# Altium schematic sheet MainCyclomotion.SchDoc: Main cyclomotion
size A3; SheetNumber: 1; SheetTotal: 1
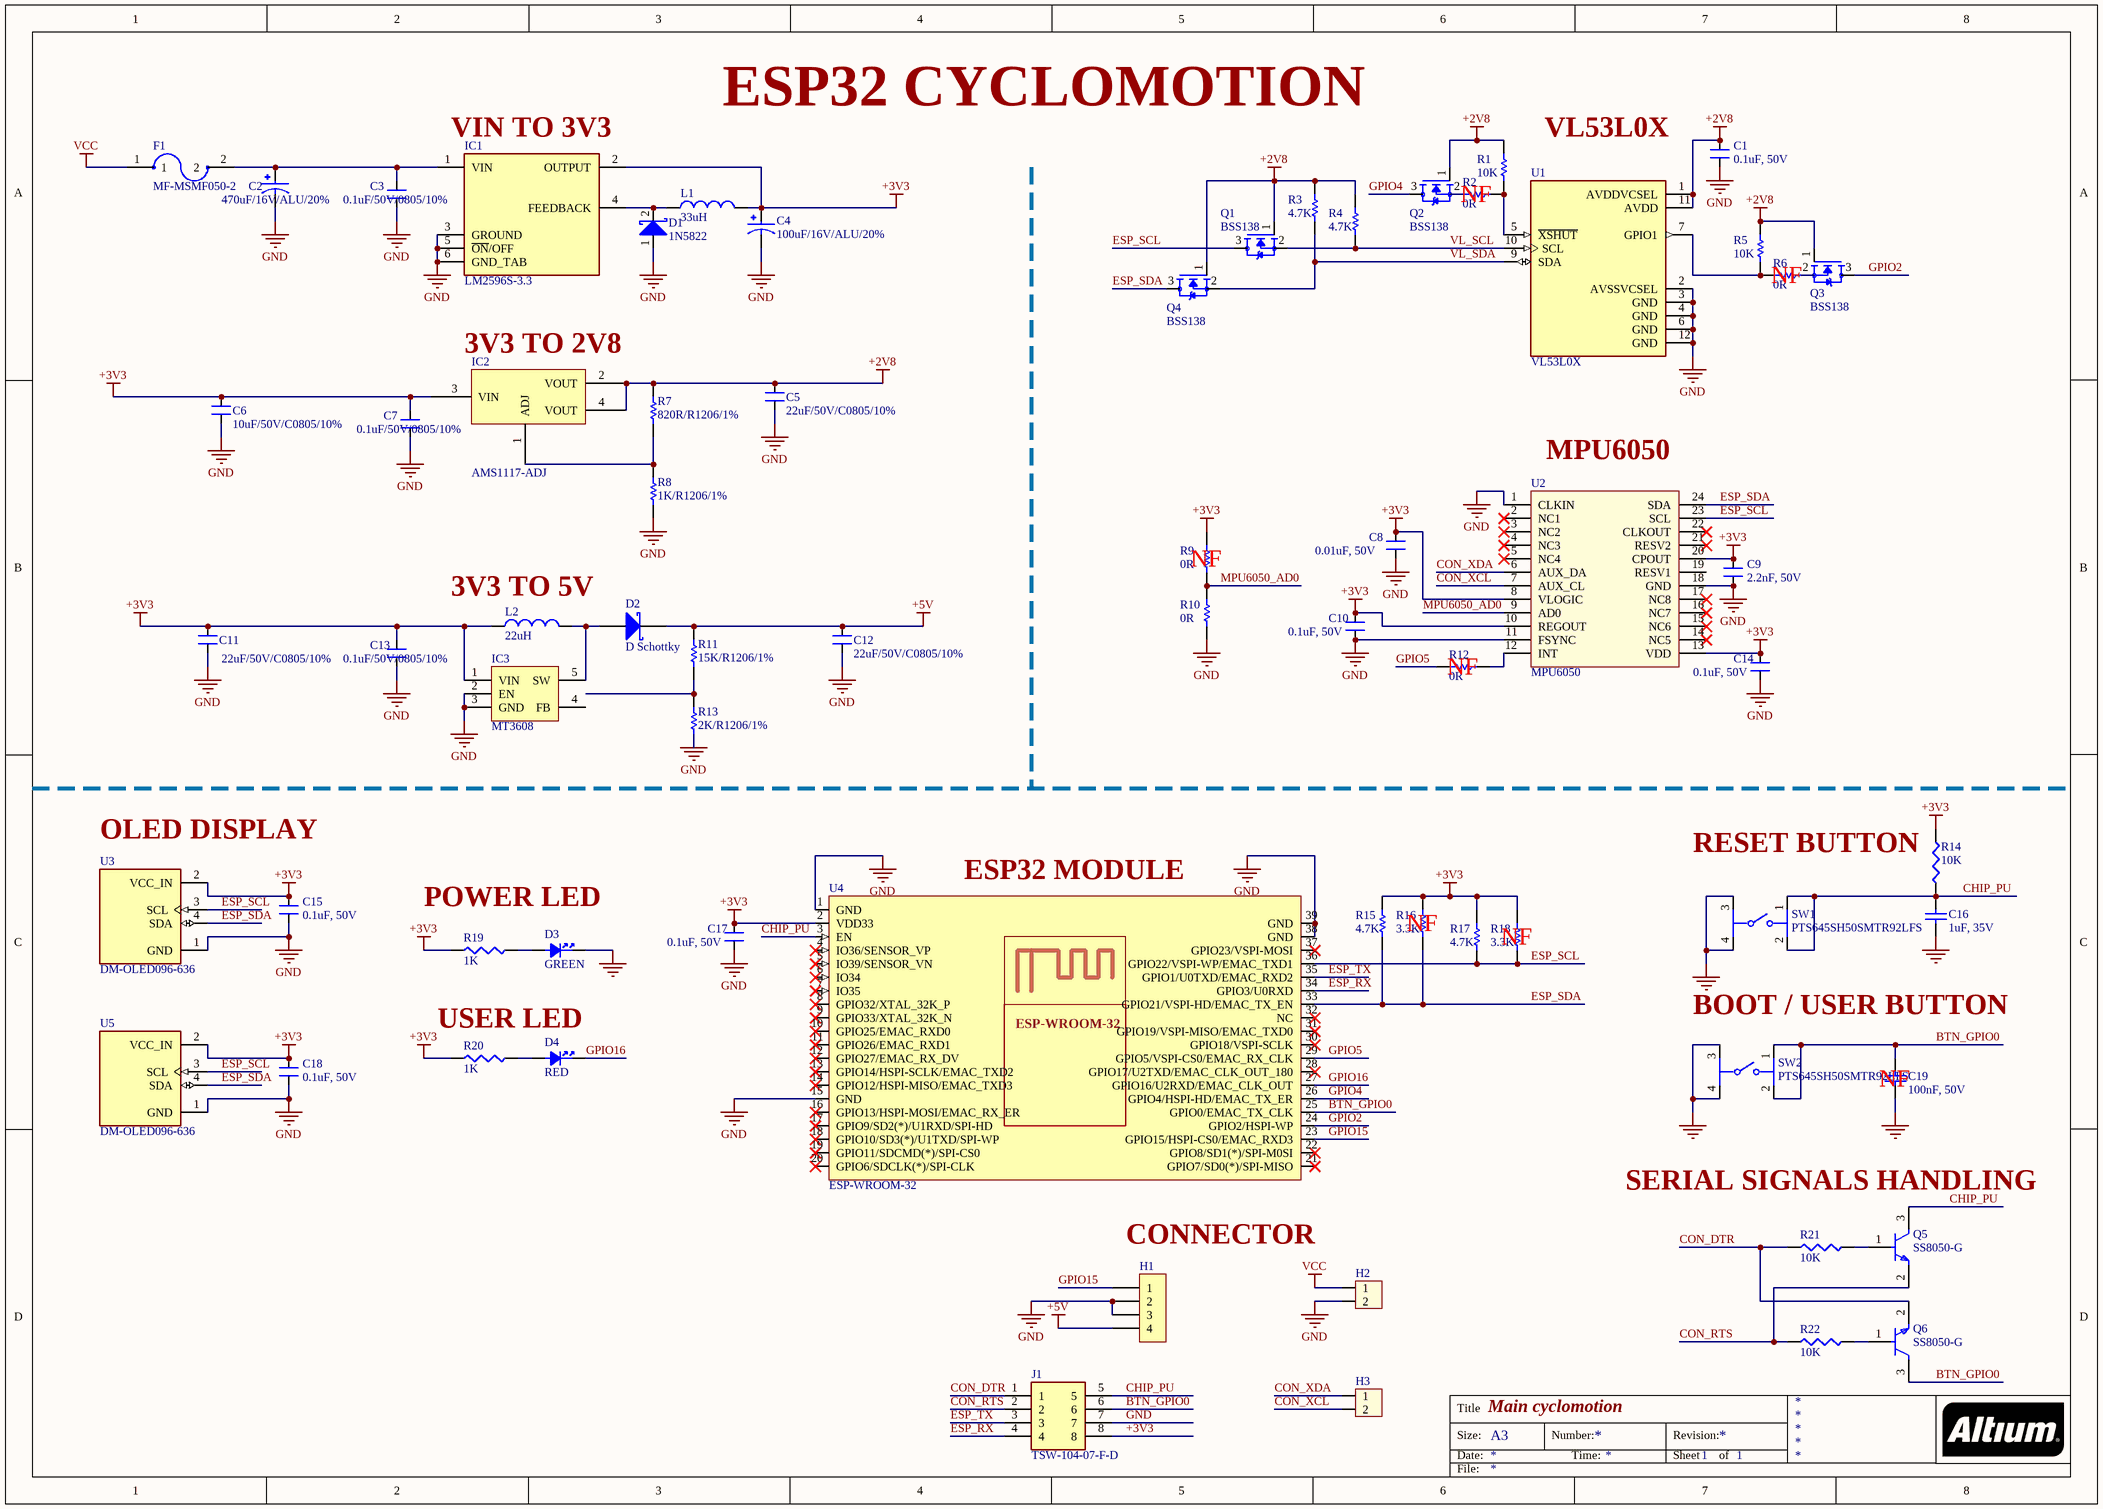
[diagram p0: MainCyclomotion.SchDoc]

## Parts
C1  0.1uF, 50V  [CAP_CERA_C2012(CC0805INCH)]
C2  470uF/16V/ALU/20%  [Cap_ALU_D_SMD]
C3  0.1uF/50V/0805/10%  [CAP_CERA_C2012(CC0805INCH)]
C4  100uF/16V/ALU/20%  [Cap_ALU_E_SMD]
C5  22uF/50V/C0805/10%  [CAP_CERA_C2012(CC0805INCH)]
C6  10uF/50V/C0805/10%  [CAP_CERA_C2012(CC0805INCH)]
C7  0.1uF/50V/0805/10%  [CAP_CERA_C2012(CC0805INCH)]
C8  0.01uF, 50V  [CAP_CERA_C2012(CC0805INCH)]
C9  2.2nF, 50V  [CAP_CERA_C2012(CC0805INCH)]
C10  0.1uF, 50V  [CAP_CERA_C2012(CC0805INCH)]
C11  22uF/50V/C0805/10%  [CAP_CERA_C2012(CC0805INCH)]
C12  22uF/50V/C0805/10%  [CAP_CERA_C2012(CC0805INCH)]
C13  0.1uF/50V/0805/10%  [CAP_CERA_C2012(CC0805INCH)]
C14  0.1uF, 50V  [CAP_CERA_C2012(CC0805INCH)]
C15  0.1uF, 50V  [CAP_CERA_C2012(CC0805INCH)]
C16  1uF, 35V  [CAPC1005X55N]
C17  0.1uF, 50V  [CAP_CERA_C2012(CC0805INCH)]
C18  0.1uF, 50V  [CAP_CERA_C2012(CC0805INCH)]
C19  100nF, 50V  [CAPC1005X55N]
D1  1N5822  [D_1N5822_DO201AD_THT]
D2  D Schottky  [DIODE SMA]
D3  GREEN  [LED0402G]
D4  RED  [LED0402R]
F1  MF-MSMF050-2  [FUSM4632X85]
H1  Header 4P 2.54 Duc Thang  [XH2.54M-4]  (value not drawn)
H2  Header 2P 2.54 Duc Thang  [XH2.54M-2]  (value not drawn)
H3  Header 2P 2.54 Duc Thang  [XH2.54M-2]  (value not drawn)
IC1  LM2596S-3.3  [TO170P1524X483-6N]
IC2  AMS1117-ADJ  [SOT223]
IC3  MT3608  [SOT23-5]
J1  TSW-104-07-F-D  [SAMTEC_TSW-104-07-F-D]
L1  value 33uH  [L_CDRH17_33uH_SMD]  (hidden comment: Inductor)
L2  value 22uH  [L_CDRH104_22uH_SMD]  (hidden comment: Inductor)
Q1  BSS138  [SOT95P240X111-3N]
Q2  BSS138  [SOT95P240X111-3N]
Q3  BSS138  [SOT95P240X111-3N]
Q4  BSS138  [SOT95P240X111-3N]
Q5  SS8050-G  [FP-SS8050-G-IPC_B]
Q6  SS8050-G  [FP-SS8050-G-IPC_B]
R1  10K  [Res 1206 SMD]
R2  0R  [Res 1206 SMD]
R3  4.7K  [Res 1206 SMD]
R4  4.7K  [Res 1206 SMD]
R5  10K  [Res 1206 SMD]
R6  0R  [Res 1206 SMD]
R7  820R/R1206/1%  [Res 1206 SMD]
R8  1K/R1206/1%  [Res 1206 SMD]
R9  0R  [Res 1206 SMD]
R10  0R  [Res 1206 SMD]
R11  15K/R1206/1%  [Res 1206 SMD]
R12  0R  [Res 1206 SMD]
R13  2K/R1206/1%  [Res 1206 SMD]
R14  10K  [RESC1005X37N]
R15  4.7K  [Res 1206 SMD]
R16  3.3K  [Res 1206 SMD]
R17  4.7K  [Res 1206 SMD]
R18  3.3K  [Res 1206 SMD]
R19  1K  [RESC1005X37N]
R20  1K  [RESC1005X37N]
R21  10K  [RESC1005X37N]
R22  10K  [RESC1005X37N]
SW1  PTS645SH50SMTR92LFS  [FP-PTS645SH50SMTR92LFS-MFG]
SW2  PTS645SH50SMTR92LFS  [FP-PTS645SH50SMTR92LFS-MFG]
U1  VL53L0X  [SENSOR_VL53L0X]
U2  MPU6050  [14# MPU -6050]
U3  DM-OLED096-636  [MODULE_DM-OLED096-636]
U4  ESP-WROOM-32  [ESP32 WROOM]
U5  DM-OLED096-636  [MODULE_DM-OLED096-636]

## Nets
+2V8: C1.1 C5.2 IC2.2(VOUT) IC2.4(VOUT) Q1.1(G) Q2.1(G) Q3.1(G) Q4.1(G) R1.2 R3.2 R4.2 R5.2 R7.1 U1.1(AVDDVCSEL) U1.11(AVDD)
+3V3: C4.1 C6.2 C7.1 C8.1 C9.1 C10.1 C11.2 C13.1 C14.1 C15.1 C17.1 C18.1 IC1.2(OUTPUT) IC2.3(VIN) IC3.1(VIN) J1.8 L1.2 L2.1 R9.2 R14.2 R15.2 R16.2 R17.2 R18.2 R19.2 R20.2 U2.8(VLOGIC) U2.10(REGOUT) U2.13(VDD) U2.20(CPOUT) U3.2(VCC_IN) U4.2(VDD33) U5.2(VCC_IN)
+5V: C12.2 D2.2(K) H1.4 R11.1
GND: C1.2 C2.2 C3.2 C4.2 C5.1 C6.1 C7.2 C8.2 C9.2 C10.2 C11.1 C12.1 C13.2 C14.2 C15.2 C16.1 C17.2 C18.2 C19.1 D1.1(A) D3.1 H1.2 H1.3 H2.2 IC1.3(GROUND) IC1.5(~{ON}/OFF) IC1.6(GND_TAB) IC3.2(EN) IC3.3(GND) J1.7 R8.2 R10.1 R13.2 SW1.3 SW1.4 SW2.3 SW2.4 U1.2(AVSSVCSEL) U1.3(GND) U1.4(GND) U1.6(GND) U1.12(GND) U2.1(CLKIN) U2.11(FSYNC) U2.18(GND) U3.1(GND) U4.1(GND) U4.15(GND) U4.38(GND) U4.39(GND) U5.1(GND)
VCC: F1.1 H2.1
BTN_GPIO0: C19.2 J1.6 Q6.3(C) SW2.1 SW2.2 U4.25(GPIO0/EMAC_TX_CLK)
CHIP_PU: C16.2 J1.5 Q5.3(C) R14.1 SW1.1 SW1.2 U4.3(EN)
CON_DTR: J1.1 Q6.2(E) R21.1
CON_RTS: J1.2 Q5.2(E) R22.1
CON_XCL: H3.2 U2.7(AUX_CL)
CON_XDA: H3.1 U2.6(AUX_DA)
ESP_RX: J1.4 U4.34(GPIO3/U0RXD)
ESP_SCL: Q1.3(D) R17.1 R18.1 U2.23(SCL) U3.3(SCL) U4.36(GPIO22/VSPI-WP/EMAC_TXD1) U5.3(SCL)
ESP_SDA: Q4.3(D) R15.1 R16.1 U2.24(SDA) U3.4(SDA) U4.33(GPIO21/VSPI-HD/EMAC_TX_EN) U5.4(SDA)
ESP_TX: J1.3 U4.35(GPIO1/U0TXD/EMAC_RXD2)
GPIO2: Q3.3(D) U4.24(GPIO2/HSPI-WP)
GPIO4: Q2.3(D) U4.26(GPIO4/HSPI-HD/EMAC_TX_ER)
GPIO5: R12.2 U4.29(GPIO5/VSPI-CS0/EMAC_RX_CLK)
GPIO15: H1.1 U4.23(GPIO15/HSPI-CS0/EMAC_RXD3)
GPIO16: D4.1 U4.27(GPIO16/U2RXD/EMAC_CLK_OUT)
MPU6050_AD0: R9.1 R10.2 U2.9(AD0)
VL_SCL: Q1.2(S) R4.1 U1.10(SCL)
VL_SDA: Q4.2(S) R3.1 U1.9(SDA)
NetC2_1: C2.1 C3.1 F1.2 IC1.1(VIN)
NetD1_2: D1.2(K) IC1.4(FEEDBACK) L1.1
NetD2_1: D2.1(A) IC3.5(SW) L2.2
NetD3_2: D3.2 R19.1
NetD4_2: D4.2 R20.1
NetIC2_1: IC2.1(ADJ) R7.2 R8.1
NetQ2_2: Q2.2(S) R2.2
NetQ3_2: Q3.2(S) R6.1
NetQ5_1: Q5.1(B) R21.2
NetQ6_1: Q6.1(B) R22.2
NetR1_1: R1.1 R2.1 U1.5(~{XSHUT})
NetR5_1: R5.1 R6.2 U1.7(GPIO1)
NetR11_2: R11.2 R13.1
NetR12_1: R12.1 U2.12(INT)

Not connected (* = marked no-connect by the designer): IC3 4(FB); U2 2(NC1)* 3(NC2)* 4(NC3)* 5(NC4)* 14(NC5)* 15(NC6)* 16(NC7)* 17(NC8)* 19(RESV1) 21(RESV2)* 22(CLKOUT)*; U4 4(IO36/SENSOR_VP)* 5(IO39/SENSOR_VN)* 6(IO34)* 7(IO35)* 8(GPIO32/XTAL_32K_P)* 9(GPIO33/XTAL_32K_N)* 10(GPIO25/EMAC_RXD0)* 11(GPIO26/EMAC_RXD1)* 12(GPIO27/EMAC_RX_DV)* 13(GPIO14/HSPI-SCLK/EMAC_TXD2)* 14(GPIO12/HSPI-MISO/EMAC_TXD3)* 16(GPIO13/HSPI-MOSI/EMAC_RX_ER)* 17(GPIO9/SD2(*)/U1RXD/SPI-HD)* 18(GPIO10/SD3(*)/U1TXD/SPI-WP)* 19(GPIO11/SDCMD(*)/SPI-CS0)* 20(GPIO6/SDCLK(*)/SPI-CLK)* 21(GPIO7/SD0(*)/SPI-MISO)* 22(GPIO8/SD1(*)/SPI-M0SI)* 28(GPIO17/U2TXD/EMAC_CLK_OUT_180)* 30(GPIO18/VSPI-SCLK)* 31(GPIO19/VSPI-MISO/EMAC_TXD0)* 32(NC)* 37(GPIO23/VSPI-MOSI)*

## Notes on the sheet
- ESP32 CYCLOMOTION
- (near IC1) VIN TO 3V3
- VL53L0X
- (near R2) NF
- (near R6) NF
- (near IC2) 3V3 TO 2V8
- (near U2) MPU6050
- (near L2) 3V3 TO 5V
- (near R9) NF
- (near R12) NF
- (near U3) OLED DISPLAY
- RESET BUTTON
- POWER LED
- (near U4) ESP32 MODULE
- (near R16) NF
- (near R18) NF
- USER LED
- BOOT / USER BUTTON
- (near C19) NF
- SERIAL SIGNALS HANDLING
- CONNECTOR
- Title
- Size:
- Date:
- A3
- Number:
- Time:
- Revision:
- Sheet
- of
- File:

## Library data of the parts
C1 C3 C5-C15 C17 C18 = CAP CERA 0805: CERAMIC CAP 0805; Value: 100pF, 2012
C2 = Cap_ALU_D_SMD
C4 = Cap_ALU_E_SMD
C16 = CL05A105KL5NRNC: CAP CER 1UF 35V X5R 0402; Manufacturer: Samsung; Dielectric Material: Ceramic; Multilayer: Yes; Tolerance  (fill in as +-): 10%; Supplier: Digikey; Supplier Part Number: 1276-6796-1-ND; Manufacturer Part Number: CL05A105KL5NRNC; RoHS: Yes; Category: Ceramic Capacitors; Stock: 469958; Pricing: 1=0.33, 10=0.212, 50=0.149, 100=0.1202, 500=0.08934, 1000=0.07818, 2500=0.07446, 5000=0.06887 (USD); Mounting Technology: Surface Mount; Pins: 2; Package Shape: Rectangular; Case/Package: 0402; Terminal Finish: Nickel; Min Operating Temperature: -55°C; Max Operating Temperature: 85°C; JESD-609 Code: e3; Value: 1uF; Capacitor Type: Ceramic; Packaging: Tape and Reel; Tolerance (fill in as +-): 10%; Rated DC Voltage (URdc): 35V; Temperature Characteristics Code: X5R; Termination: Wraparound; Reach SVHC Compliant: Yes; RoHS Compliant: Yes; ComponentLink1URL: https://datasheet.ciiva.com:443/pdfs/VipMasterIC/IC/SEMS/SEMS-S-A0008384515/SEMS-S-A0008872905-1.pdf?src-supplier=IHS+Markit; ComponentLink1Description: https://datasheet.ciiva.com:443/pdfs/VipMasterIC/IC/SEMS/SEMS-S-A0008384515/SEMS-S-A0008872905-1.pdf?src-supplier=IHS+Markit; ComponentLink2URL: http://www.samsungsem.com/kr/support/product-search/mlcc/CL05A105KL5NRNC.jsp?src-supplier=Digikey; ComponentLink2Description: http://www.samsungsem.com/kr/support/product-search/mlcc/CL05A105KL5NRNC.jsp?src-supplier=Digikey; LCSC Part Number: C307413
C19 = CL05B104KB54PNC: CAP CER 0.1UF 50V X7R 0402; Manufacturer: Samsung; Dielectric Material: Ceramic; Supplier: Digikey; Supplier Part Number: 1276-CL05B104KB54PNCCT-ND; Manufacturer Part Number: CL05B104KB54PNC; RoHS: Yes; Category: Ceramic Capacitors; Stock: 1237875; Pricing: 1=0.1, 10=0.044, 50=0.025, 100=0.0194, 500=0.0146, 1000=0.01147, 2500=0.01043, 5000=0.00959 (USD); Pins: 2; Capacitor Type: Ceramic; RoHS Compliant: Yes; Reach SVHC Compliant: Yes; ComponentLink1URL: https://datasheet.ciiva.com:443/pdfs/VipMasterIC/IC/SEMS/SEMS-S-A0006318249/SEMS-S-A0006320959-1.pdf?src-supplier=IHS+Markit; ComponentLink1Description: https://datasheet.ciiva.com:443/pdfs/VipMasterIC/IC/SEMS/SEMS-S-A0006318249/SEMS-S-A0006320959-1.pdf?src-supplier=IHS+Markit; ComponentLink2URL: https://datasheet.octopart.com/CL05B104KB54PNC-Samsung-datasheet-8326407.pdf?src-supplier=TME; ComponentLink2Description: https://datasheet.octopart.com/CL05B104KB54PNC-Samsung-datasheet-8326407.pdf?src-supplier=TME; LCSC Part Number: C307331
D1 = 1N5822: Schottky Diode 3A 40V DO-201AD; ComponentLink1Description: Datasheet; ComponentLink1URL: D:\Dropbox\Datasheets\Diodes and Rectifiers\Diodes\1N582X.pdf; Unit Price: 0.1667
D2 = D Schottky: Schottky Diode; Published: 8-Jun-2000; LatestRevisionDate: 17-Jul-2002; LatestRevisionNote: Re-released for DXP Platform.; PackageReference: SMB; Publisher: Altium Limited; PackageDescription: DO-214-AA/SMB; 2 C-Bend Leads; Body 5.3 x 3.6 mm, inc. leads (LxW); Code_JEDEC: DO-214-AA
D3 = VLMG1500-GS08: LED YLW-GRN 0402 SMD; Manufacturer: Vishay; Color: Green,Yellow; Lens Color: Clear; Viewing Angle: 130°; Forward Current: 30mA; Forward Voltage: 2V; Luminous Intensity: 35mcd; Dominant Wavelength: 571nm; Test Current: 20mA; Number of Elements: 1; Power Dissipation: 75mW; Lens Style: Rectangular; Reverse Voltage: 5V; Supplier: Digikey; Supplier Part Number: VLMG1500-GS08CT-ND; Manufacturer Part Number: VLMG1500-GS08; RoHS: Yes; Category: LEDs; Stock: 98; Pricing: 1=0.34, 10=0.265, 100=0.119, 500=0.10746, 1000=0.08827 (USD); Mounting Technology: Surface Mount; Case/Package: 0402; Pins: 2; Case Code (Metric): 1005; Case Code (Imperial): 0402; Min Operating Temperature: -30°C; Max Operating Temperature: 85°C; Package Quantity: 1; Packaging: Tape and Reel; Illumination Color: Green; Wavelength: 571nm; Number of LEDs: 1; Power Rating: 75mW; Series: CHipLED; Length: 1mm; Width: 0.5mm; Height: 0.35mm; Depth: 0.5mm; Radiation Hardening: No; Lead Free: Lead Free; RoHS Compliant: Yes; Reach SVHC Compliant: Unknown; ComponentLink1URL: https://datasheet.ciiva.com/12071/vlmo1500-244705-12071911.pdf?src-supplier=Mouser; ComponentLink1Description: https://datasheet.ciiva.com/12071/vlmo1500-244705-12071911.pdf?src-supplier=Mouser; ComponentLink2URL: https://datasheet.ciiva.com/30005/vlmo1500-30005134.pdf?src-supplier=Avnet; ComponentLink2Description: https://datasheet.ciiva.com/30005/vlmo1500-30005134.pdf?src-supplier=Avnet; LCSC Part Number: C511404
D4 = VLMS1500-GS08: LED RED 0402 SMD; Manufacturer: Vishay; Shape: Rectangular; Forward Current: 30mA; Forward Voltage: 2.4V; Luminous Intensity-Nom: 54mcd; Channels: 1; Optoelectronic Device Type: SINGLE COLOR LED; Reverse Voltage-Max: 5V; Viewing Angle: 130°; Overall Height: 0.35mm; Supplier: Digikey; Supplier Part Number: VLMS1500-GS08CT-ND; Manufacturer Part Number: VLMS1500-GS08; RoHS: Yes; Category: LEDs; Stock: 70376; Pricing: 1=0.34, 10=0.265, 100=0.119, 500=0.10746, 1000=0.08827 (USD); Mounting Technology: Surface Mount; Pins: 2; Color: Red; Color@wavelength: Red; Min Operating Temperature: -30°C; Max Operating Temperature: 85°C; Packaging: Tape and Reel; Size: 0.5mm; Terminal Pitch: 0.95mm; Reach SVHC Compliant: Yes; RoHS Compliant: Yes; ComponentLink1URL: https://datasheet.ciiva.com:443/pdfs/VipMasterIC/IC/VISH/VISH-S-A0003457490/VISH-S-A0003457490-1.pdf?src-supplier=IHS+Markit; ComponentLink1Description: https://datasheet.ciiva.com:443/pdfs/VipMasterIC/IC/VISH/VISH-S-A0003457490/VISH-S-A0003457490-1.pdf?src-supplier=IHS+Markit; ComponentLink2URL: http://www.farnell.com/datasheets/1809983.pdf?src-supplier=Farnell; ComponentLink2Description: http://www.farnell.com/datasheets/1809983.pdf?src-supplier=Farnell; ComponentLink3URL: http://www.mouser.com/ds/2/427/vlmo1500-244705.pdf?src-supplier=Mouser; ComponentLink3Description: http://www.mouser.com/ds/2/427/vlmo1500-244705.pdf?src-supplier=Mouser; ComponentLink4URL: https://datasheet.octopart.com/VLMS1500-GS08-Vishay-datasheet-62332426.pdf?src-supplier=Newark; ComponentLink4Description: https://datasheet.octopart.com/VLMS1500-GS08-Vishay-datasheet-62332426.pdf?src-supplier=Newark; ComponentLink5URL: https://datasheet.octopart.com/VLMS1500-GS08-Vishay-datasheet-33014519.pdf?src-supplier=Element14; ComponentLink5Description: https://datasheet.octopart.com/VLMS1500-GS08-Vishay-datasheet-33014519.pdf?src-supplier=Element14; ComponentLink6URL: http://datasheet.octopart.com/VLMS1500-GS08-Vishay-datasheet-21227148.pdf?src-supplier=Avnet; ComponentLink6Description: http://datasheet.octopart.com/VLMS1500-GS08-Vishay-datasheet-21227148.pdf?src-supplier=Avnet; ComponentLink7URL: http://www.farnell.com/datasheets/1809983.pdf?src-supplier=Newark; ComponentLink7Description: http://www.farnell.com/datasheets/1809983.pdf?src-supplier=Newark; ComponentLink8URL: http://www.farnell.com/datasheets/2050839.pdf?src-supplier=Newark; ComponentLink8Description: http://www.farnell.com/datasheets/2050839.pdf?src-supplier=Newark; ComponentLink9URL: http://datasheet.octopart.com/VLMS1500-GS08-Vishay-datasheet-21227148.pdf?src-supplier=Quest; ComponentLink9Description: http://datasheet.octopart.com/VLMS1500-GS08-Vishay-datasheet-21227148.pdf?src-supplier=Quest; ComponentLink10URL: http://datasheet.octopart.com/VLMS1500-GS08-Vishay-datasheet-21227148.pdf?src-supplier=NAC+Semi; ComponentLink10Description: http://datasheet.octopart.com/VLMS1500-GS08-Vishay-datasheet-21227148.pdf?src-supplier=NAC+Semi; LCSC Part Number: C511370
F1 = MF-MSMF050-2: Polymeric PTC Resettable Fuse 15V 500 mA Ih Surface Mount 1812 (4532 Metric), Concave; MF: Bourns; MP: MF-MSMF050-2; Availability: In Stock; Check_prices: https://www.snapeda.com/parts/MF-MSMF050-2/Bourns+-+J.W.+Miller/view-part/?ref=eda; Price: None; Package: 1812 Bourns; Purchase-URL: https://pricing.snapeda.com/search/part/MF-MSMF050-2/?ref=eda; Value: *; SnapEDA_Link: https://www.snapeda.com/parts/MF-MSMF050-2/Bourns+-+J.W.+Miller/view-part/?ref=snap
H1 = Header 4P 2.54 Duc Thang: Cắm; Ten_Linh_Kien: Header 4P XH2.54-4P Đực Thẳng; Don_Vi: Con; Ma_Hang: MH001285; Chung_Loai: Cắm
H2 H3 = Header 2P 2.54 Duc Thang: Cắm; Ten_Linh_Kien: Header 2P XH2.54-2P Đực Thẳng; Don_Vi: Con; Ma_Hang: MH001283; Chung_Loai: Cắm
IC1 = LM2596S-3.3: SIMPLE SWITCHER® 4.5V to 40V, 3A Low Component Count Step-Down Regulator
IC2 = AMS1117 SMD: Dán; Value: AMS1117-3.3V SOT223; Don_Vi: Con; Ma_Hang: MH000596; Ghi_Chu: *; Kieu_Chan: *; Chung_Loai: Dán
IC3 = MT3608: The MT3608 is a constant frequency, 6-pin SOT23 / current mode step-up converter; Manufacturer: AEROSEMI; Alternate Part Number-1: NA; Manufacturer Part Number: MT3608; Case/Package: SOT-23-5; Supplier-1: NA; Supplier Part Number-1: NA
L1 L2 = Inductor: Code_IEC: 1005; Published: 8-Jun-2000; LatestRevisionDate: 29-May-2009; LatestRevisionNote: IPC-7351 Footprint Added.; PackageReference: 0402-A; Publisher: Altium Limited; PackageDescription: Chip Inductor; Code_JEITA: 0402
Q1-Q4 = BSS138: N-Channel 50 V 220mA (Ta) 350mW (Ta) Surface Mount SOT-23-3
Q5 Q6 = SS8050-G: TRANS NPN 25V 1.5A SOT23-3; Manufacturer: Comchip; Supplier: Digikey; Supplier Part Number: 641-1790-1-ND; Manufacturer Part Number: SS8050-G; RoHS: Yes; Category: Transistors; Stock: 108568; Pricing: 1=0.29, 10=0.2, 100=0.0978, 500=0.08154, 1000=0.05666 (USD); Reach SVHC Compliant: Yes; RoHS Compliant: Yes; ComponentLink1URL: https://datasheet.ciiva.com:443/pdfs/VipMasterIC/IC/COMC/COMC-S-A0004994192/COMC-S-A0004994192-1.pdf?src-supplier=IHS+Markit; ComponentLink1Description: https://datasheet.ciiva.com:443/pdfs/VipMasterIC/IC/COMC/COMC-S-A0004994192/COMC-S-A0004994192-1.pdf?src-supplier=IHS+Markit; ComponentLink2URL: http://www.comchiptech.com/admin/files/product/SS8050-G RevA181526.pdf?src-supplier=Digikey; ComponentLink2Description: http://www.comchiptech.com/admin/files/product/SS8050-G RevA181526.pdf?src-supplier=Digikey; LCSC Part Number: C164886
R1-R13 R15-R18 = RES-1206: RES SMD 10K OHM 1% 1206; Manufacturer: Yageo; Manufacturer Part Number: RC1206FR-075R1L; Resistance (Ohms): 5.1; Power (Watts): 0.25W, 1/4W; Temperature Coefficient: ±200ppm/°C; Supplier 1: Digi-Key; RoHS: RoHS Compliant; Category: Resistors; Stock 1: 96701; Pricing 1: 1=0.1, 10=0.051, 100=0.0207, 1000=0.0093, 2500=0.00807 (USD); Packaging: Cut Tape (CT); Part Status: Active; Tolerance: ±1%; Composition: Thick Film; Features: Moisture Resistant; Operating Temperature: -55°C ~ 155°C; Package / Case: 1206 (3216 Metric); Supplier Device Package: 1206; Size / Dimension: 0.122" L x 0.063" W (3.10mm x 1.60mm); Height - Seated (Max): 0.026" (0.65mm); Failure Rate: -; ComponentLink1URL: http://www.yageo.com/documents/recent/PYu-RC_Group_51_RoHS_L_7.pdf; ComponentLink1Description: http://www.yageo.com/documents/recent/PYu-RC_Group_51_RoHS_L_7.pdf; Supplier Part Number 1: 311-5.10FRCT-ND
R14 R21 R22 = AC0402FR-0710KL: RES SMD 10K OHM 1% 1/16W 0402; Manufacturer: Yageo; Additional Feature: LASER TRIMMABLE; Power: 62.5mW; Rated Temperature: 70°C; Value: 10kR; Temperature Coefficient: 100ppm/°C; Working Voltage: 50V; Package Height: 0.32mm; Package Length: 1mm; Package Width: 0.5mm; Reference Standard: AEC-Q200; Supplier: Digikey; Supplier Part Number: YAG3436CT-ND; Manufacturer Part Number: AC0402FR-0710KL; RoHS: Yes; Category: Chip SMD Resistors; Stock: 1122213; Pricing: 1=0.1, 10=0.019, 50=0.0116, 100=0.0095, 500=0.00638, 1000=0.00544, 5000=0.00391 (USD); Mounting Technology: Surface Mount; Pins: 2; Package Shape: Rectangular; Case/Package: 0402; Terminal Finish: Nickel; Min Operating Temperature: -55°C; Max Operating Temperature: 155°C; Tolerance: 1%; JESD-609 Code: e3; Resistor Type: FIXED RESISTOR; Construction: Chip; Package Style: SMTMeter; Packaging: Tape and Reel; Technology: METAL GLAZE/THICK FILM; Termination: Wraparound; Reach SVHC Compliant: Yes; RoHS Compliant: Yes; ComponentLink1URL: https://datasheet.ciiva.com:443/pdfs/VipMasterIC/IC/YAGO/YAGO-S-A0003597364/YAGO-S-A0003597364-1.pdf?src-supplier=IHS+Markit; ComponentLink1Description: https://datasheet.ciiva.com:443/pdfs/VipMasterIC/IC/YAGO/YAGO-S-A0003597364/YAGO-S-A0003597364-1.pdf?src-supplier=IHS+Markit; ComponentLink2URL: https://datasheet.ciiva.com/12656/pyu-ac-51-rohs-l-2-12656634.pdf?src-supplier=Mouser; ComponentLink2Description: https://datasheet.ciiva.com/12656/pyu-ac-51-rohs-l-2-12656634.pdf?src-supplier=Mouser; LCSC Part Number: C144807
R19 R20 = RC0402FR-071KL: RES 1K OHM 1% 1/16W 0402; Manufacturer: Yageo; Additional Feature: LASER TRIMMABLE; Power: 62.5mW; Rated Temperature: 70°C; Value: 1kR; Temperature Coefficient: 100ppm/°C; Working Voltage: 50V; Package Height: 0.35mm; Package Length: 1mm; Package Width: 0.5mm; Supplier: Digikey; Supplier Part Number: 311-1.00KLRCT-ND; Manufacturer Part Number: RC0402FR-071KL; RoHS: Yes; Category: Chip SMD Resistors; Stock: 11967525; Pricing: 1=0.1, 10=0.015, 50=0.0088, 100=0.0073, 500=0.00488, 1000=0.00417, 5000=0.00297 (USD); Mounting Technology: Surface Mount; Pins: 2; Package Shape: Rectangular; Case/Package: 0402; Terminal Finish: Nickel; Min Operating Temperature: -55°C; Max Operating Temperature: 155°C; Tolerance: 1%; JESD-609 Code: e3; Resistor Type: FIXED RESISTOR; Construction: Chip; Package Style: SMTMeter; Packaging: Tape and Reel; Technology: METAL GLAZE/THICK FILM; Termination: Wraparound; Reach SVHC Compliant: Yes; RoHS Compliant: Yes; ComponentLink1URL: https://datasheet.ciiva.com:443/pdfs/VipMasterIC/IC/YAGO/YAGO-S-A0008145938/YAGO-S-A0008145938-1.pdf?src-supplier=IHS+Markit; ComponentLink1Description: https://datasheet.ciiva.com:443/pdfs/VipMasterIC/IC/YAGO/YAGO-S-A0008145938/YAGO-S-A0008145938-1.pdf?src-supplier=IHS+Markit; ComponentLink2URL: https://datasheet.ciiva.com/11819/0900766b80c66297-11819477.pdf?src-supplier=Rs; ComponentLink2Description: https://datasheet.ciiva.com/11819/0900766b80c66297-11819477.pdf?src-supplier=Rs; ComponentLink3URL: https://datasheet.ciiva.com/22747/1018594-22747513.pdf?src-supplier=Element14; ComponentLink3Description: https://datasheet.ciiva.com/22747/1018594-22747513.pdf?src-supplier=Element14; ComponentLink4URL: https://datasheet.ciiva.com/12666/pyu-rc0402-51-rohs-l-6-r-12666741.pdf?src-supplier=Mouser; ComponentLink4Description: https://datasheet.ciiva.com/12666/pyu-rc0402-51-rohs-l-6-r-12666741.pdf?src-supplier=Mouser; ComponentLink5URL: https://datasheet.ciiva.com/17063/pyu-rc0402-51-rohs-l-6-r-17063193.pdf?src-supplier=Future+Electronics; ComponentLink5Description: https://datasheet.ciiva.com/17063/pyu-rc0402-51-rohs-l-6-r-17063193.pdf?src-supplier=Future+Electronics; ComponentLink6URL: https://datasheet.ciiva.com/7983/1018594-7983502.pdf?src-supplier=Element14; ComponentLink6Description: https://datasheet.ciiva.com/7983/1018594-7983502.pdf?src-supplier=Element14; ComponentLink7URL: https://datasheet.ciiva.com/7849/1018594-7849869.pdf?src-supplier=Element14; ComponentLink7Description: https://datasheet.ciiva.com/7849/1018594-7849869.pdf?src-supplier=Element14; ComponentLink8URL: https://datasheet.ciiva.com/7849/1018594-7849871.pdf?src-supplier=Element14; ComponentLink8Description: https://datasheet.ciiva.com/7849/1018594-7849871.pdf?src-supplier=Element14; LCSC Part Number: C106235
SW1 SW2 = PTS645SH50SMTR92LFS: SWITCH TACTILE SPST-NO 0.05A 12V; Manufacturer: ITT C&K; Manufacturer Series: PTS645; Actuator Type: Pushbutton; Contact Current(DC)-Max: 50mA; Contact DC Max Rating R Load: 0.05A@12VDC; Contact Resistance: 0.1mR; Dielectric Withstand Volts: 250VACV; Electrical Life: 100000Cycles; Insulation Resistance: 100GR; PCB Hole Count: 4; Switch Action: MOMENTARY; Switch Function: SPST; Switch Type: Keypad; Body Breadth: 5.9944inch; Body Height: 3.4544mm; Body Length or Diameter: 5.9944mm; Supplier: Digikey; Supplier Part Number: CKN9085CT-ND; Manufacturer Part Number: PTS645SH50SMTR92LFS; RoHS: Yes; Category: Tactile Switches; Stock: 64637; Pricing: 1=0.35, 10=0.337, 25=0.3172, 100=0.2753, 250=0.24972, 500=0.2323 (USD); Mounting Technology: Surface Mount; Terminal Finish: Silver; Min Operating Temperature: -20°C; Max Operating Temperature: 60°C; JESD-609 Code: e4; Contact Voltage(DC)-Max: 12V; Termination: Solder; Terminal Length: 0.138inch; Reach SVHC Compliant: Yes; RoHS Compliant: Yes; ComponentLink1URL: https://datasheet.ciiva.com:443/pdfs/VipMasterIC/IC/CKCI/CKCI-S-A0001796527/CKCI-S-A0001796842-1.pdf?src-supplier=IHS+Markit; ComponentLink1Description: https://datasheet.ciiva.com:443/pdfs/VipMasterIC/IC/CKCI/CKCI-S-A0001796527/CKCI-S-A0001796842-1.pdf?src-supplier=IHS+Markit; ComponentLink2URL: https://datasheet.ciiva.com/29903/getdatasheetpartid-773702-29903807.pdf?src-supplier=Verical; ComponentLink2Description: https://datasheet.ciiva.com/29903/getdatasheetpartid-773702-29903807.pdf?src-supplier=Verical; ComponentLink3URL: https://datasheet.ciiva.com/14920/pts645-14920741.pdf?src-supplier=Digikey; ComponentLink3Description: https://datasheet.ciiva.com/14920/pts645-14920741.pdf?src-supplier=Digikey; ComponentLink4URL: https://datasheet.ciiva.com/22637/1707731-22637356.pdf?src-supplier=Element14; ComponentLink4Description: https://datasheet.ciiva.com/22637/1707731-22637356.pdf?src-supplier=Element14; LCSC Part Number: C221869
U1 = VL53L0X: VL53L0X - Light, 3D Time-of-Flight _ToF_ Sensor Evaluation Board; MF: STMicroelectronics; MP: VL53L0X; Package: None; Price: None; Availability: Unavailable; SnapEDA_Link: https://www.snapeda.com/parts/VL53L0X/STMicroelectronics/view-part/473967/?ref=snap; Value: *
U3 U5 = DM-OLED096-636: 0.96â€ 128 X 64 MONOCHROME GRAPHIC OLED DISPLAY MODULE - I2C; SnapEDA_Link: https://www.snapeda.com/parts/DM-OLED096-636/Display+Module/view-part/?ref=snap; Package: Package; Value: *; MF: Display Module; MP: DM-OLED096-636; Check_prices: https://www.snapeda.com/parts/DM-OLED096-636/Display+Module/view-part/?ref=eda
U2 = MPU6050: Case/Package: QFN; Supplier 1: RSComponents